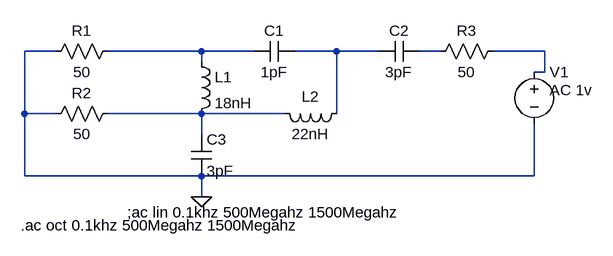
[diagram p0: schematic RXinputFilterSim.asc]
RXinputFilterSim.asc, the LTspice schematic file:
Version 4
SHEET 1 1020 680
WIRE -112 192 -160 192
WIRE 112 192 -32 192
WIRE 192 192 112 192
WIRE 320 192 256 192
WIRE 384 192 320 192
WIRE 480 192 448 192
WIRE 640 192 560 192
WIRE 112 208 112 192
WIRE 640 224 640 192
WIRE 640 224 624 224
WIRE -160 288 -160 192
WIRE -112 288 -160 288
WIRE 112 288 -32 288
WIRE 240 288 112 288
WIRE 320 288 320 192
WIRE 112 320 112 288
WIRE -160 384 -160 288
WIRE 112 384 -160 384
WIRE 624 384 624 304
WIRE 624 384 112 384
WIRE 112 416 112 384
FLAG 112 416 0
SYMBOL cap 256 176 R90
WINDOW 0 0 32 VBottom 2
WINDOW 3 32 32 VTop 2
SYMATTR InstName C1
SYMATTR Value 1pF
SYMBOL cap 448 176 R90
WINDOW 0 0 32 VBottom 2
WINDOW 3 32 32 VTop 2
SYMATTR InstName C2
SYMATTR Value 3pF
SYMBOL cap 96 320 R0
SYMATTR InstName C3
SYMATTR Value 3pF
SYMBOL ind 96 192 R0
SYMATTR InstName L1
SYMATTR Value 18nH
SYMBOL ind 336 272 R90
WINDOW 0 5 56 VBottom 2
WINDOW 3 32 56 VTop 2
SYMATTR InstName L2
SYMATTR Value 22nH
SYMBOL voltage 624 208 R0
WINDOW 3 24 72 Left 2
WINDOW 123 24 44 Left 2
WINDOW 39 0 0 Left 2
SYMATTR InstName V1
SYMATTR Value ""
SYMATTR Value2 AC 1v
SYMBOL res -16 176 R90
WINDOW 0 0 56 VBottom 2
WINDOW 3 32 56 VTop 2
SYMATTR InstName R1
SYMATTR Value 50
SYMBOL res -16 272 R90
WINDOW 0 0 56 VBottom 2
WINDOW 3 32 56 VTop 2
SYMATTR InstName R2
SYMATTR Value 50
SYMBOL res 576 176 R90
WINDOW 0 0 56 VBottom 2
WINDOW 3 32 56 VTop 2
SYMATTR InstName R3
SYMATTR Value 50
TEXT -2 440 Left 2 !;ac lin 0.1khz 500Megahz 1500Megahz
TEXT -166 460 Left 2 !.ac oct 0.1khz 500Megahz 1500Megahz

The netlist it stands for:
* RXinputFilterSim.asc
C1 N002 N001 1pF
C2 N003 N002 3pF
C3 N005 0 3pF
L1 N001 N005 18nH
L2 N002 N005 22nH
V1 N004 0 AC 1v
R1 N001 0 50
R2 N005 0 50
R3 N004 N003 50
;ac lin 0.1khz 500Megahz 1500Megahz
.ac oct 0.1khz 500Megahz 1500Megahz
.backanno
.end